# EAGLE design rev19schem (EAGLE 6.4)
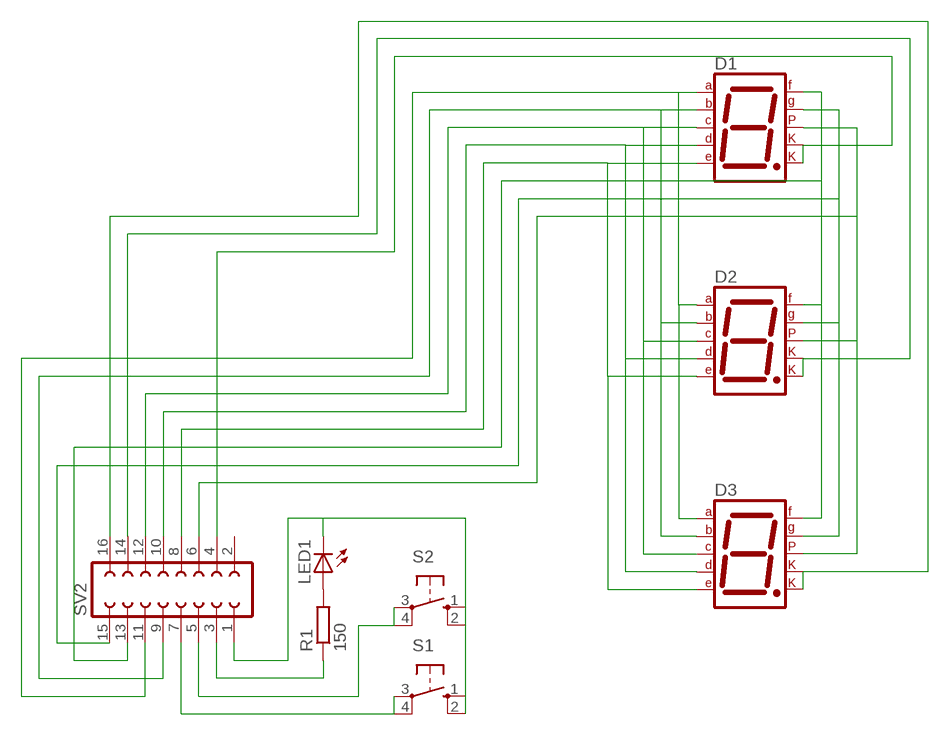
[diagram p0: schematic, sheet 1]

## Parts
D1  7SEG-CK  [7SEG-13]
D2  7SEG-CK  [7SEG-13]
D3  7SEG-CK  [7SEG-13]
LED1  LED5MM  [LED5MM]
R1  150  R-EU_R0805  [R0805]
S1  10-XX  [B3F-10XX]
S2  10-XX  [B3F-10XX]
SV2  FE08-2  [FE08-2]

## Nets
N$2: D1.6(B) D2.6(B) D3.6(B) SV2.9
N$3: D1.4(C) D2.4(C) D3.4(C) SV2.12
N$4: D1.2(D) D2.2(D) D3.2(D) SV2.10
N$5: D1.1(E) D2.1(E) D3.1(E) SV2.8
N$6: D1.9(F) D2.9(F) D3.9(F) SV2.13
N$7: D1.10(G) D2.10(G) D3.10(G) SV2.15
N$8: D1.5(DP) D2.5(DP) D3.5(DP) SV2.6
N$9: D1.3(CK1) D1.8(CK2) SV2.4
N$10: D2.3(CK1) D2.8(CK2) SV2.14
N$11: D3.3(CK1) D3.8(CK2) SV2.16
N$12: D1.7(A) D2.7(A) D3.7(A) SV2.11
N$15: LED1.K(C) S1.1(S) S1.2(S1) S2.1(S) S2.2(S1) SV2.1
N$19: LED1.A R1.2
N$20: R1.1 SV2.3
N$22: S2.3(P) S2.4(P1) SV2.5
N$23: S1.3(P) S1.4(P1) SV2.7
Unconnected: SV2.2

## Library data of the parts
D1-D3 = special:7SEG-CK: 7-segment DISPLAY single cathode, 13 mm
LED1 = led:LED: LED OSRAM: - CHIPLED LG R971, LG N971, LY N971, LG Q971, LY Q971, LO R971, LY R971 LH N974, LH R974 LS Q976, LO Q976, LY Q976 LO Q996 - Hyper CHIPLED LW Q18S LB Q993, LB Q99A, LB R99A - SideLED LS A670, LO A670, LY A670, LG A670, LP A670 LB A673, LV A673, LT A673, LW A673 LH A674 LY A675 LS A676, LA A676, LO A676, LY A676, LW A676 LS A679, LY A679, LG A679 - Hyper Micro SIDELED® LS Y876, LA Y876, LO Y876, LY Y876 LT Y87S - SmartLED LW L88C, LW L88S LB L89C, LB L89S, LG L890 LS L89K, LO L89K, LY L89K LS L896, LA L896, LO L896, LY L896 - TOPLED LS T670, LO T670, LY T670, LG T670, LP T670 LSG T670, LSP T670, LSY T670, LOP T670, LYG T670 LG T671, LOG T671, LSG T671 LB T673, LV T673, LT T673, LW T673 LH T674 LS T676, LA T676, LO T676, LY T676, LB T676, LH T676, LSB T676, LW T676 LB T67C, LV T67C, LT T67C, LS T67K, LO T67K, LY T67K, LW E67C LS E67B, LA E67B, LO E67B, LY E67B, LB E67C, LV E67C, LT E67C LW T67C LS T679, LY T679, LG T679 LS T770, LO T770, LY T770, LG T770, LP T770 LB T773, LV T773, LT T773, LW T773 LH T774 LS E675, LA E675, LY E675, LS T675 LS T776, LA T776, LO T776, LY T776, LB T776 LHGB T686 LT T68C, LB T68C - Hyper Mini TOPLED® LB M676 - Mini TOPLED Santana® LG M470 LS M47K, LO M47K, LY M47K Source: http://www.osram.convergy.de LUXEON: - LUMILED® LXK2-PW12-R00, LXK2-PW12-S00, LXK2-PW14-U00, LXK2-PW14-V00 LXK2-PM12-R00, LXK2-PM12-S00, LXK2-PM14-U00 LXK2-PE12-Q00, LXK2-PE12-R00, LXK2-PE12-S00, LXK2-PE14-T00, LXK2-PE14-U00 LXK2-PB12-K00, LXK2-PB12-L00, LXK2-PB12-M00, LXK2-PB14-N00, LXK2-PB14-P00, LXK2-PB14-Q00 LXK2-PR12-L00, LXK2-PR12-M00, LXK2-PR14-Q00, LXK2-PR14-R00 LXK2-PD12-Q00, LXK2-PD12-R00, LXK2-PD12-S00 LXK2-PH12-R00, LXK2-PH12-S00 LXK2-PL12-P00, LXK2-PL12-Q00, LXK2-PL12-R00 Source: www.luxeon.com KINGBRIGHT: KA-3528ASYC Source: www.kingbright.com
R1 = resistor:R-EU_: RESISTOR, European symbol
S1 S2 = switch-omron:10-XX: OMRON SWITCH; MPN: B3F-1000; OC_FARNELL: 176432; OC_NEWARK: 36M3542
SV2 = con-lsta:FE08-2: FEMALE HEADER; OC_FARNELL: unknown; OC_NEWARK: unknown

## Board
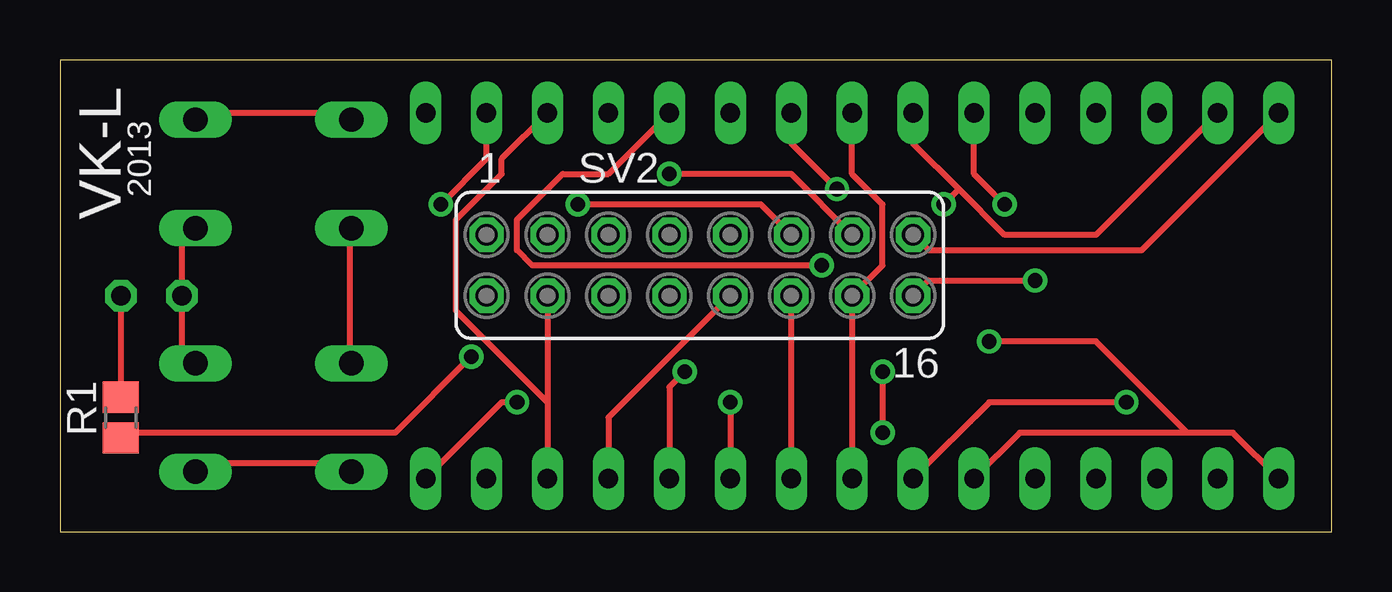
[diagram p1: board, top side]
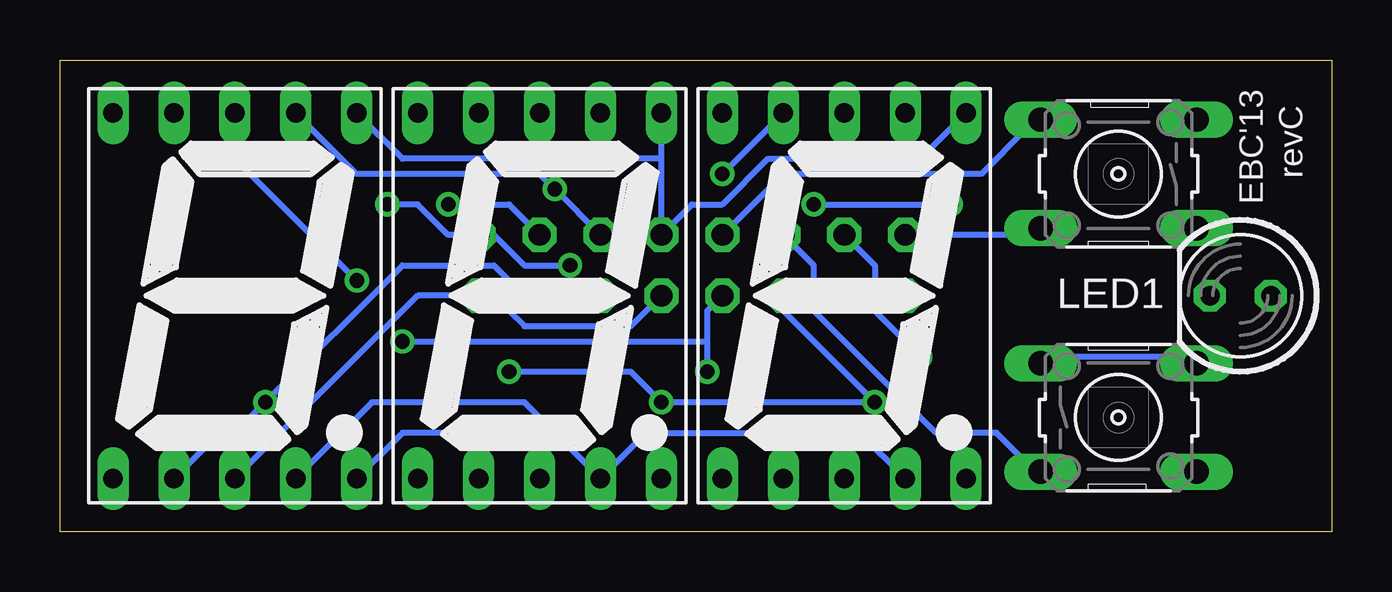
[diagram p2: board, bottom side, seen from below]

Size 53.01 x 19.68 mm. Coordinates in mm from the lower left corner, seen from the top.
Outline: 0,0 53.01,0 53.01,19.68 0,19.68 0,0
Copper layers (1*16): Top 0.035mm / dielectric 1.5mm / Bottom 0.035mm
Design rules "default": minimum track width 10mil, minimum drill 24mil, track to track 8mil, track to pad 8mil, pad to pad 8mil, via to via 8mil, smd to smd 8mil, copper to edge 40mil, drill to drill 8mil, minimum pad ring 10mil, minimum via ring 8mil, stop-mask expansion 4mil, vias tented up to drill 0mil, thermal gap 10mil

### Footprints (pad centres in the part's own frame; a part is rotated, then mirrored left to right if it is on the bottom)
7SEG-13 = drill 0.813 long: 1 -5.08,-7.62; 2 -2.54,-7.62; 3 0,-7.62; 4 2.54,-7.62; 5 5.08,-7.62; 6 5.08,7.62; 7 2.54,7.62; 8 0,7.62; 9 -2.54,7.62; 10 -5.08,7.62
LED5MM = drill 0.813 octagon: A -1.27,0; K 1.27,0
R0805 = smd 1.3 x 1.5: 1 -0.85,0; 2 0.85,0
B3F-10XX = drill 1.016 long: 1 -3.251,2.261; 2 3.251,2.261; 3 -3.251,-2.261; 4 3.251,-2.261
FE08-2 = drill 0.914 octagon: 1 -8.89,1.27; 2 -8.89,-1.27; 3 -6.35,1.27; 4 -6.35,-1.27; 5 -3.81,1.27; 6 -3.81,-1.27; 7 -1.27,1.27; 8 -1.27,-1.27; 9 1.27,1.27; 10 1.27,-1.27; 11 3.81,1.27; 12 3.81,-1.27; 13 6.35,1.27; 14 6.35,-1.27; 15 8.89,1.27; 16 8.89,-1.27

### Placement (x,y rotation side)
D1  20.32,9.84 0 bottom
D2  33.02,9.84 0 bottom
D3  45.72,9.84 0 bottom
LED1  3.81,9.84 180 bottom
R1  2.54,4.76 90 top
S1  8.89,14.92 180 bottom
S2  8.89,4.76 0 bottom
SV2  26.67,11.11 0 top

### Tracks (layer width: path | path; a pad name or v marks a point on that pad's centre or on a via)
N$2
  Bottom 0.254: D1.6 17.14,15.56 23.5,15.56 25.4,13.65 26.67,13.65 SV2.9 27.94,15.56 | 27.94,15.56 D2.6 | D3.6 38.73,15.56 27.94,15.56
N$3
  Top 0.254: D2.4 SV2.12
  Bottom 0.254: D1.4 19.68,4.13 28.57,4.13 D2.4 33.66,5.4 40.01,5.4 D3.4
N$4  (via drill 0.61)
  Top 0.254: D1.2 22.86,4.76 SV2.10 | D2.2 38.73,5.4 v44.45,5.4
  Bottom 0.254: D3.2 46.35,4.13 45.72,4.13 v44.45,5.4 38.73,11.11 34.92,11.11 34.29,10.48 34.29,9.21 33.66,8.57 29.21,8.57 SV2.10
N$5  (via drill 0.61)
  Top 0.254: D1.1 25.4,6.03 v26.04,6.67 | D2.1 40.01,4.13 46.99,4.13 | 46.99,4.13 48.9,4.13 D3.1 | v38.73,7.94 43.18,7.94 46.99,4.13
  Bottom 0.254: 26.04,7.94 26.04,9.21 SV2.8 | 26.04,7.94 v26.04,6.67 | v38.73,7.94 26.04,7.94
N$6  (via drill 0.61)
  Top 0.254: v25.4,14.92 30.48,14.92 SV2.13 | D2.9 35.56,16.19 37.47,14.29 | 37.47,14.29 39.37,12.38 43.18,12.38 D3.9 | 37.47,14.29 v36.83,13.65
  Bottom 0.254: v25.4,14.92 D1.9 | SV2.13 34.29,13.65 v36.83,13.65
N$7  (via drill 0.61)
  Top 0.254: D1.10 22.86,14.92 20.95,14.92 19.05,13.02 19.05,11.75 19.68,11.11 v31.75,11.11 | D2.10 38.1,14.92 v39.37,13.65 | D3.10 45.09,11.75 36.2,11.75 SV2.15
  Bottom 0.254: v31.75,11.11 33.66,11.11 34.92,12.38 SV2.15 36.83,12.38 38.1,13.65 v39.37,13.65
N$8  (via drill 0.61)
  Top 0.254: D1.5 18.41,5.4 v19.05,5.4 | v27.94,5.4 D2.5 | v34.29,6.67 v34.29,4.13
  Bottom 0.254: SV2.6 22.86,9.21 v19.05,5.4 v27.94,5.4 29.21,6.67 v34.29,6.67 | D3.5 38.73,4.13 v34.29,4.13
N$9
  Top 0.254: SV2.4 20.32,5.4 | 20.32,5.4 D1.3 | D1.8 18.41,15.56 18.41,14.92 16.51,13.02 16.51,9.21 20.32,5.4
N$10
  Top 0.254: D2.3 SV2.14 34.29,11.11 34.29,13.65 33.02,14.92 D2.8
N$11  (via drill 0.61)
  Top 0.254: v40.64,10.48 36.2,10.48 SV2.16
  Bottom 0.254: D3.3 38.1,9.84 SV2.16 | D3.8 45.72,15.56 v40.64,10.48
N$12  (via drill 0.61)
  Top 0.254: D1.7 17.78,15.56 v15.88,13.65 | v21.59,13.65 29.21,13.65 SV2.11 | D2.7 30.48,16.19 v32.38,14.29
  Bottom 0.254: v21.59,13.65 v15.88,13.65 | SV2.11 v32.38,14.29 33.02,14.92 40.64,14.92 D3.7
N$15
  Top 0.254: S1.1 5.08,12.38 LED1.K 5.08,7.3 S2.2 | S2.1 12.06,7.3 12.06,12.38 S1.2
  Bottom 0.254: SV2.1 12.7,12.38 S1.2 | S2.2 5.71,7.3 12.06,7.3 S2.1
N$19
  Top 0.254: LED1.A R1.2
N$20  (via drill 0.61)
  Top 0.254: v17.14,7.3 13.97,4.13 2.54,4.13 R1.1
  Bottom 0.254: v17.14,7.3 19.05,9.21 19.05,11.11 SV2.3
N$22
  Top 0.254: S2.4 5.71,2.86 12.06,2.86 S2.3
  Bottom 0.254: SV2.5 21.59,11.11 21.59,9.21 16.51,4.13 13.97,4.13 12.7,2.86 S2.3
N$23
  Top 0.254: S1.3 5.71,17.46 12.06,17.46 S1.4
  Bottom 0.254: SV2.7 22.86,14.92 14.61,14.92 12.7,16.83 S1.4

### Text on the board
tNames: 2013 | VK-L
bNames: revC | EBC'13